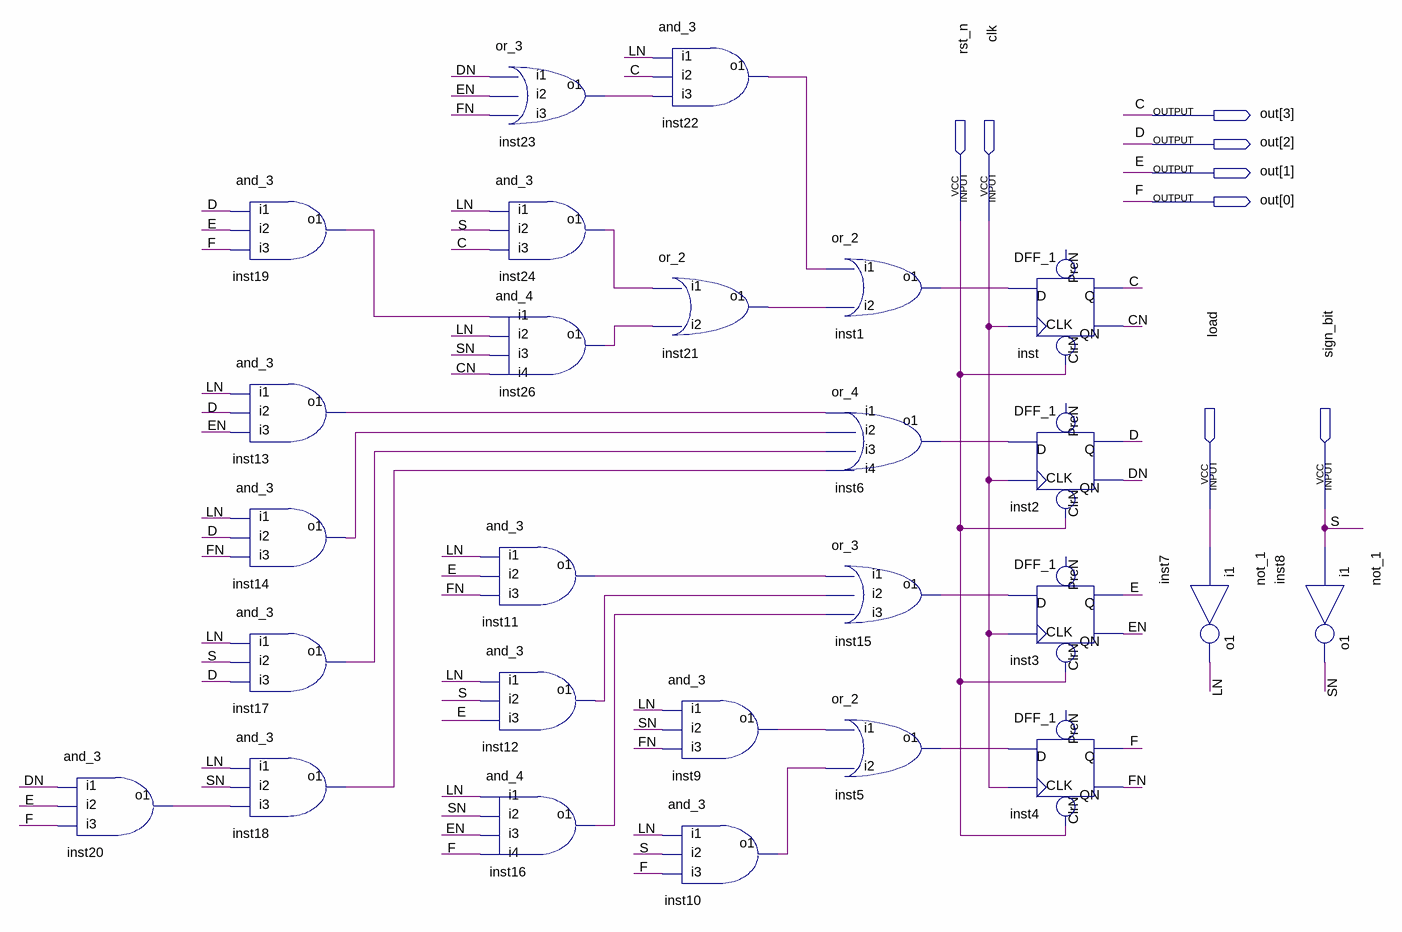
[diagram p0: schematic sheet]
// Quartus schematic Counter.bdf as structural Verilog: 26 symbols, 8 pins
module Counter (
  input  rst_n,
  input  clk,
  input  load,
  input  sign_bit,
  output [3:0] out
);

  wire CN, DN, EN, FN, inst1_o1, inst5_o1, inst6_o1, inst9_o1, inst10_o1, inst11_o1, inst12_o1, inst13_o1,
       inst14_o1, inst15_o1, inst16_o1, inst17_o1, inst18_o1, inst19_o1, inst20_o1, inst21_o1, inst22_o1,
       inst23_o1, inst24_o1, inst26_o1, LN, SN;

  and_3 inst20 (.i1(DN), .i2(out[1]), .i3(out[0]), .o1(inst20_o1));
  and_3 inst19 (.i1(out[2]), .i2(out[1]), .i3(out[0]), .o1(inst19_o1));
  and_3 inst13 (.i1(LN), .i2(out[2]), .i3(EN), .o1(inst13_o1));
  and_3 inst14 (.i1(LN), .i2(out[2]), .i3(FN), .o1(inst14_o1));
  and_3 inst17 (.i1(LN), .i2(sign_bit), .i3(out[2]), .o1(inst17_o1));
  and_3 inst18 (.i1(LN), .i2(SN), .i3(inst20_o1), .o1(inst18_o1));
  and_3 inst11 (.i1(LN), .i2(out[1]), .i3(FN), .o1(inst11_o1));
  and_3 inst12 (.i1(LN), .i2(sign_bit), .i3(out[1]), .o1(inst12_o1));
  and_4 inst16 (.i1(LN), .i2(SN), .i3(EN), .i4(out[0]), .o1(inst16_o1));
  or_3 inst23 (.i1(DN), .i2(EN), .i3(FN), .o1(inst23_o1));
  and_3 inst24 (.i1(LN), .i2(sign_bit), .i3(out[3]), .o1(inst24_o1));
  and_4 inst26 (.i1(inst19_o1), .i2(LN), .i3(SN), .i4(CN), .o1(inst26_o1));
  and_3 inst22 (.i1(LN), .i2(out[3]), .i3(inst23_o1), .o1(inst22_o1));
  or_2 inst21 (.i1(inst24_o1), .i2(inst26_o1), .o1(inst21_o1));
  and_3 inst9 (.i1(LN), .i2(SN), .i3(FN), .o1(inst9_o1));
  and_3 inst10 (.i1(LN), .i2(sign_bit), .i3(out[0]), .o1(inst10_o1));
  or_2 inst1 (.i1(inst22_o1), .i2(inst21_o1), .o1(inst1_o1));
  or_4 inst6 (.i1(inst13_o1), .i2(inst14_o1), .i3(inst17_o1), .i4(inst18_o1), .o1(inst6_o1));
  or_3 inst15 (.i1(inst11_o1), .i2(inst12_o1), .i3(inst16_o1), .o1(inst15_o1));
  or_2 inst5 (.i1(inst9_o1), .i2(inst10_o1), .o1(inst5_o1));
  DFF_1 inst (.CLK(clk), .D(inst1_o1), .ClrN(rst_n), .QN(CN), .Q(out[3]));  // open: PreN
  DFF_1 inst2 (.CLK(clk), .D(inst6_o1), .ClrN(rst_n), .QN(DN), .Q(out[2]));  // open: PreN
  DFF_1 inst3 (.CLK(clk), .D(inst15_o1), .ClrN(rst_n), .QN(EN), .Q(out[1]));  // open: PreN
  DFF_1 inst4 (.CLK(clk), .D(inst5_o1), .ClrN(rst_n), .QN(FN), .Q(out[0]));  // open: PreN
  not_1 inst7 (.i1(load), .o1(LN));
  not_1 inst8 (.i1(sign_bit), .o1(SN));

  // Other names for the same wires on the sheet: C = out[3]; D = out[2]; E = out[1]; F = out[0]; S = sign_bit
endmodule
